# EAGLE schematic interfacez_main_r2_5 (EAGLE 6.4)
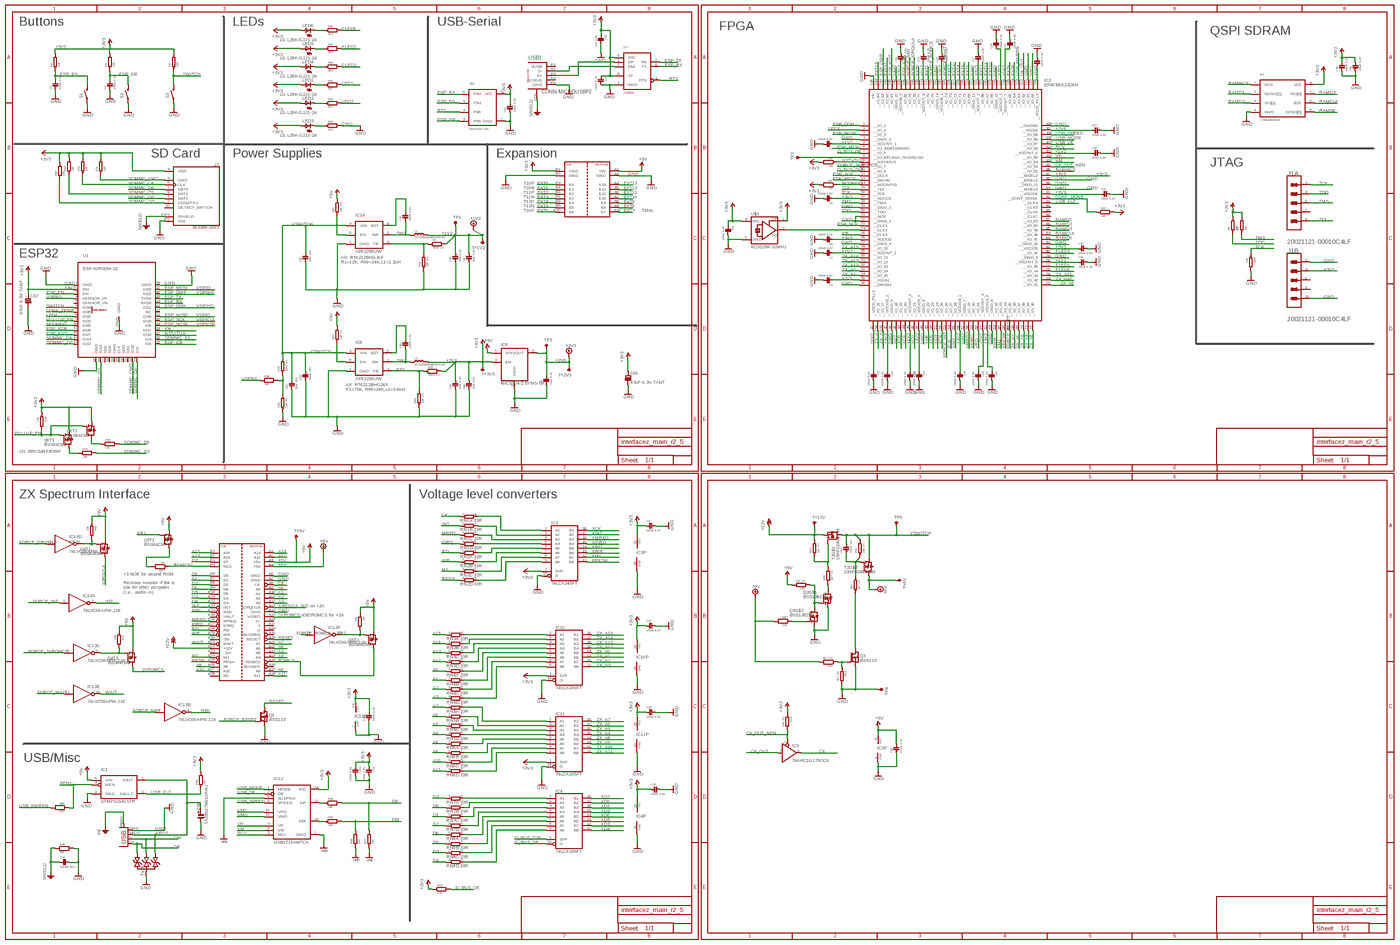
[diagram p0: schematic, sheet 1, overview]
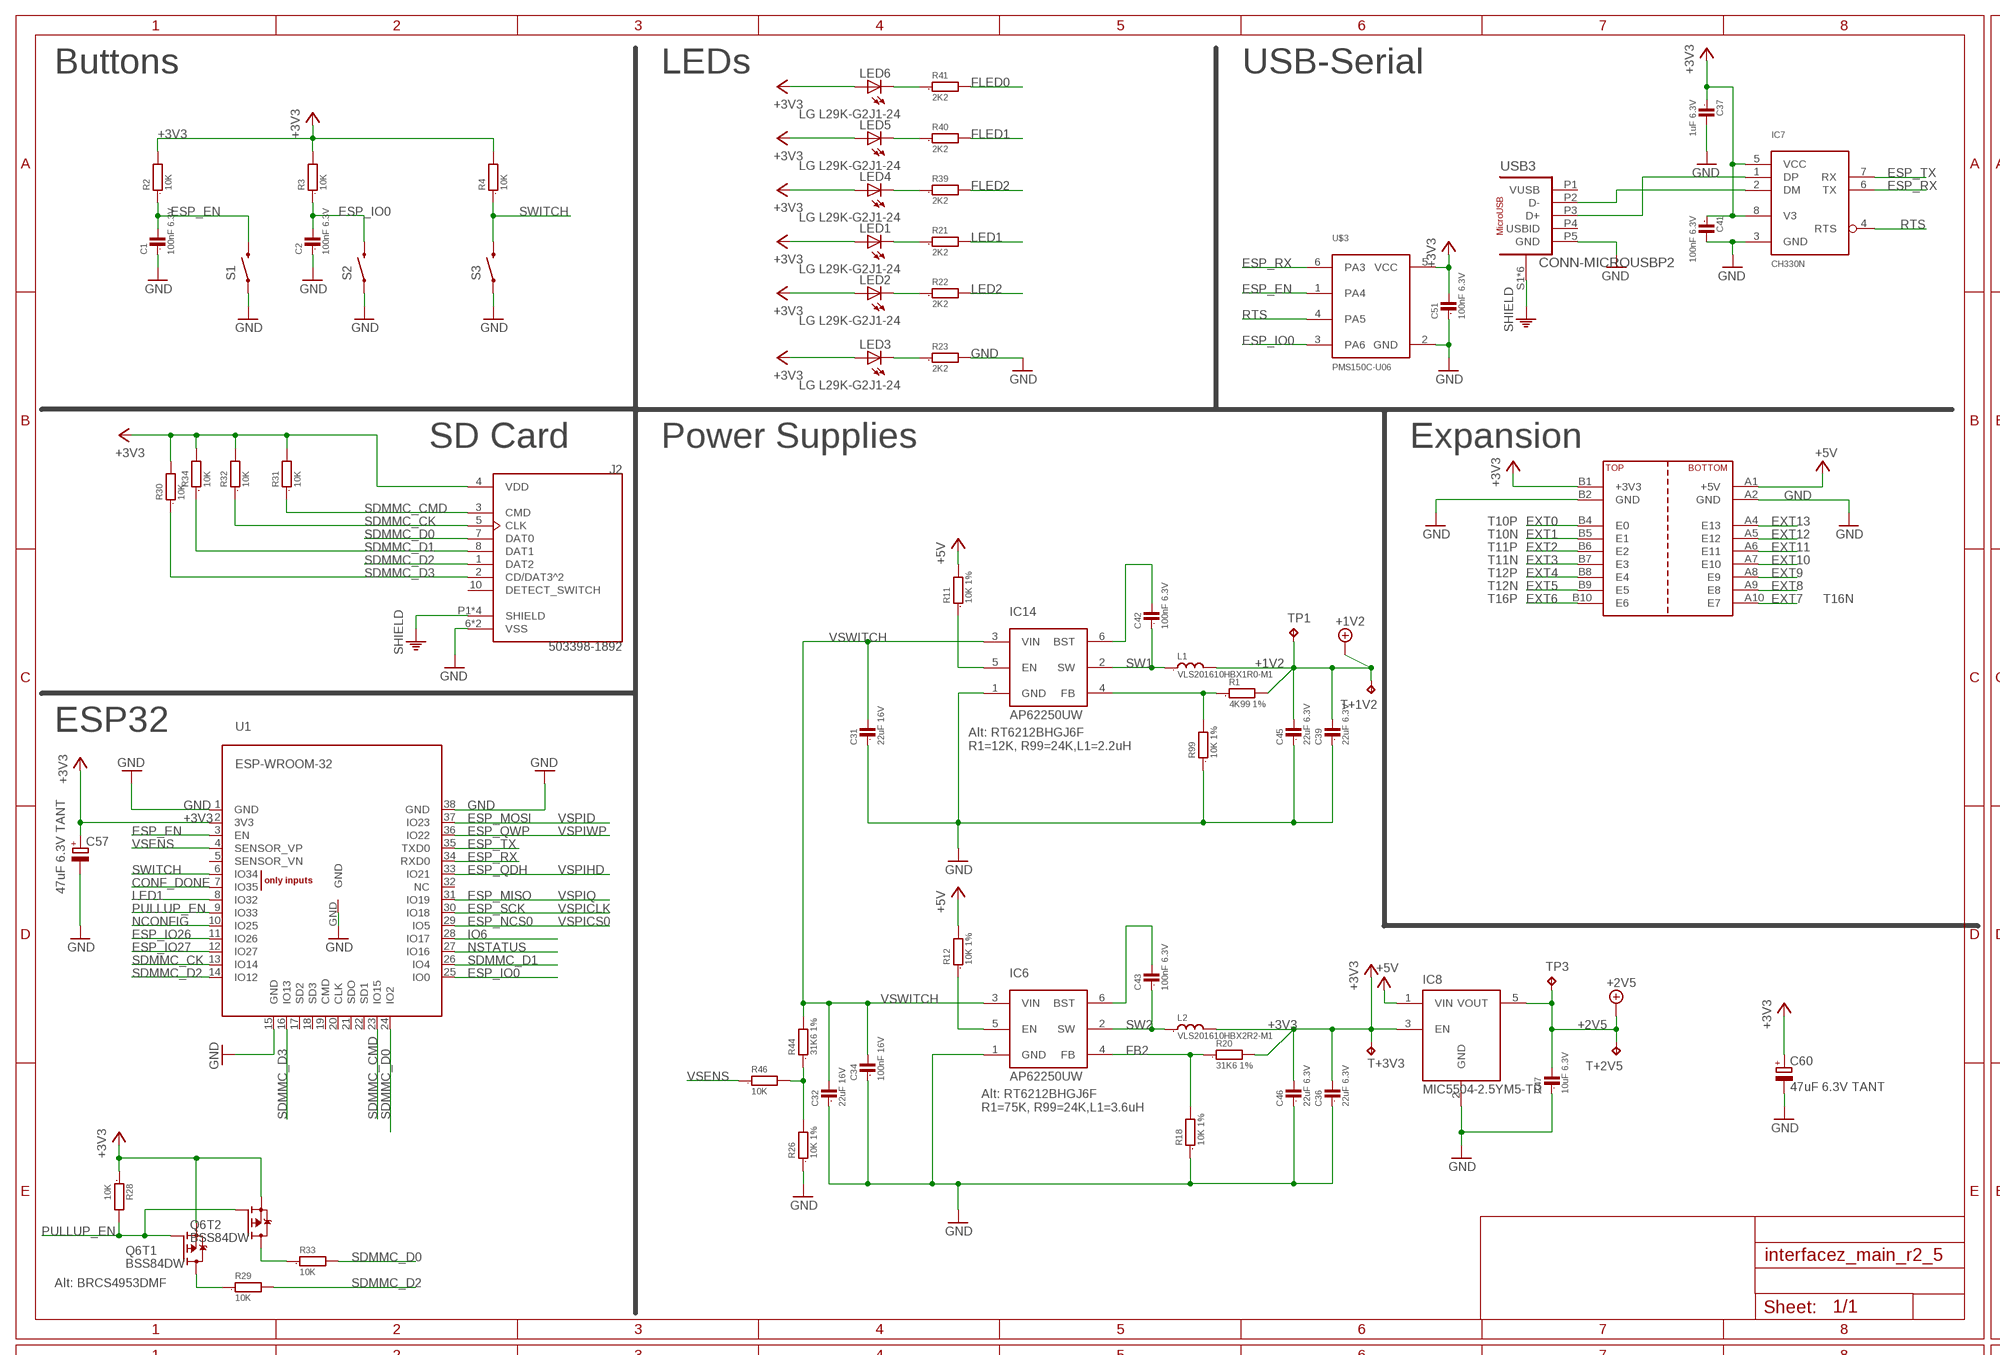
[diagram p1: schematic, sheet 1, part 1 of 4]
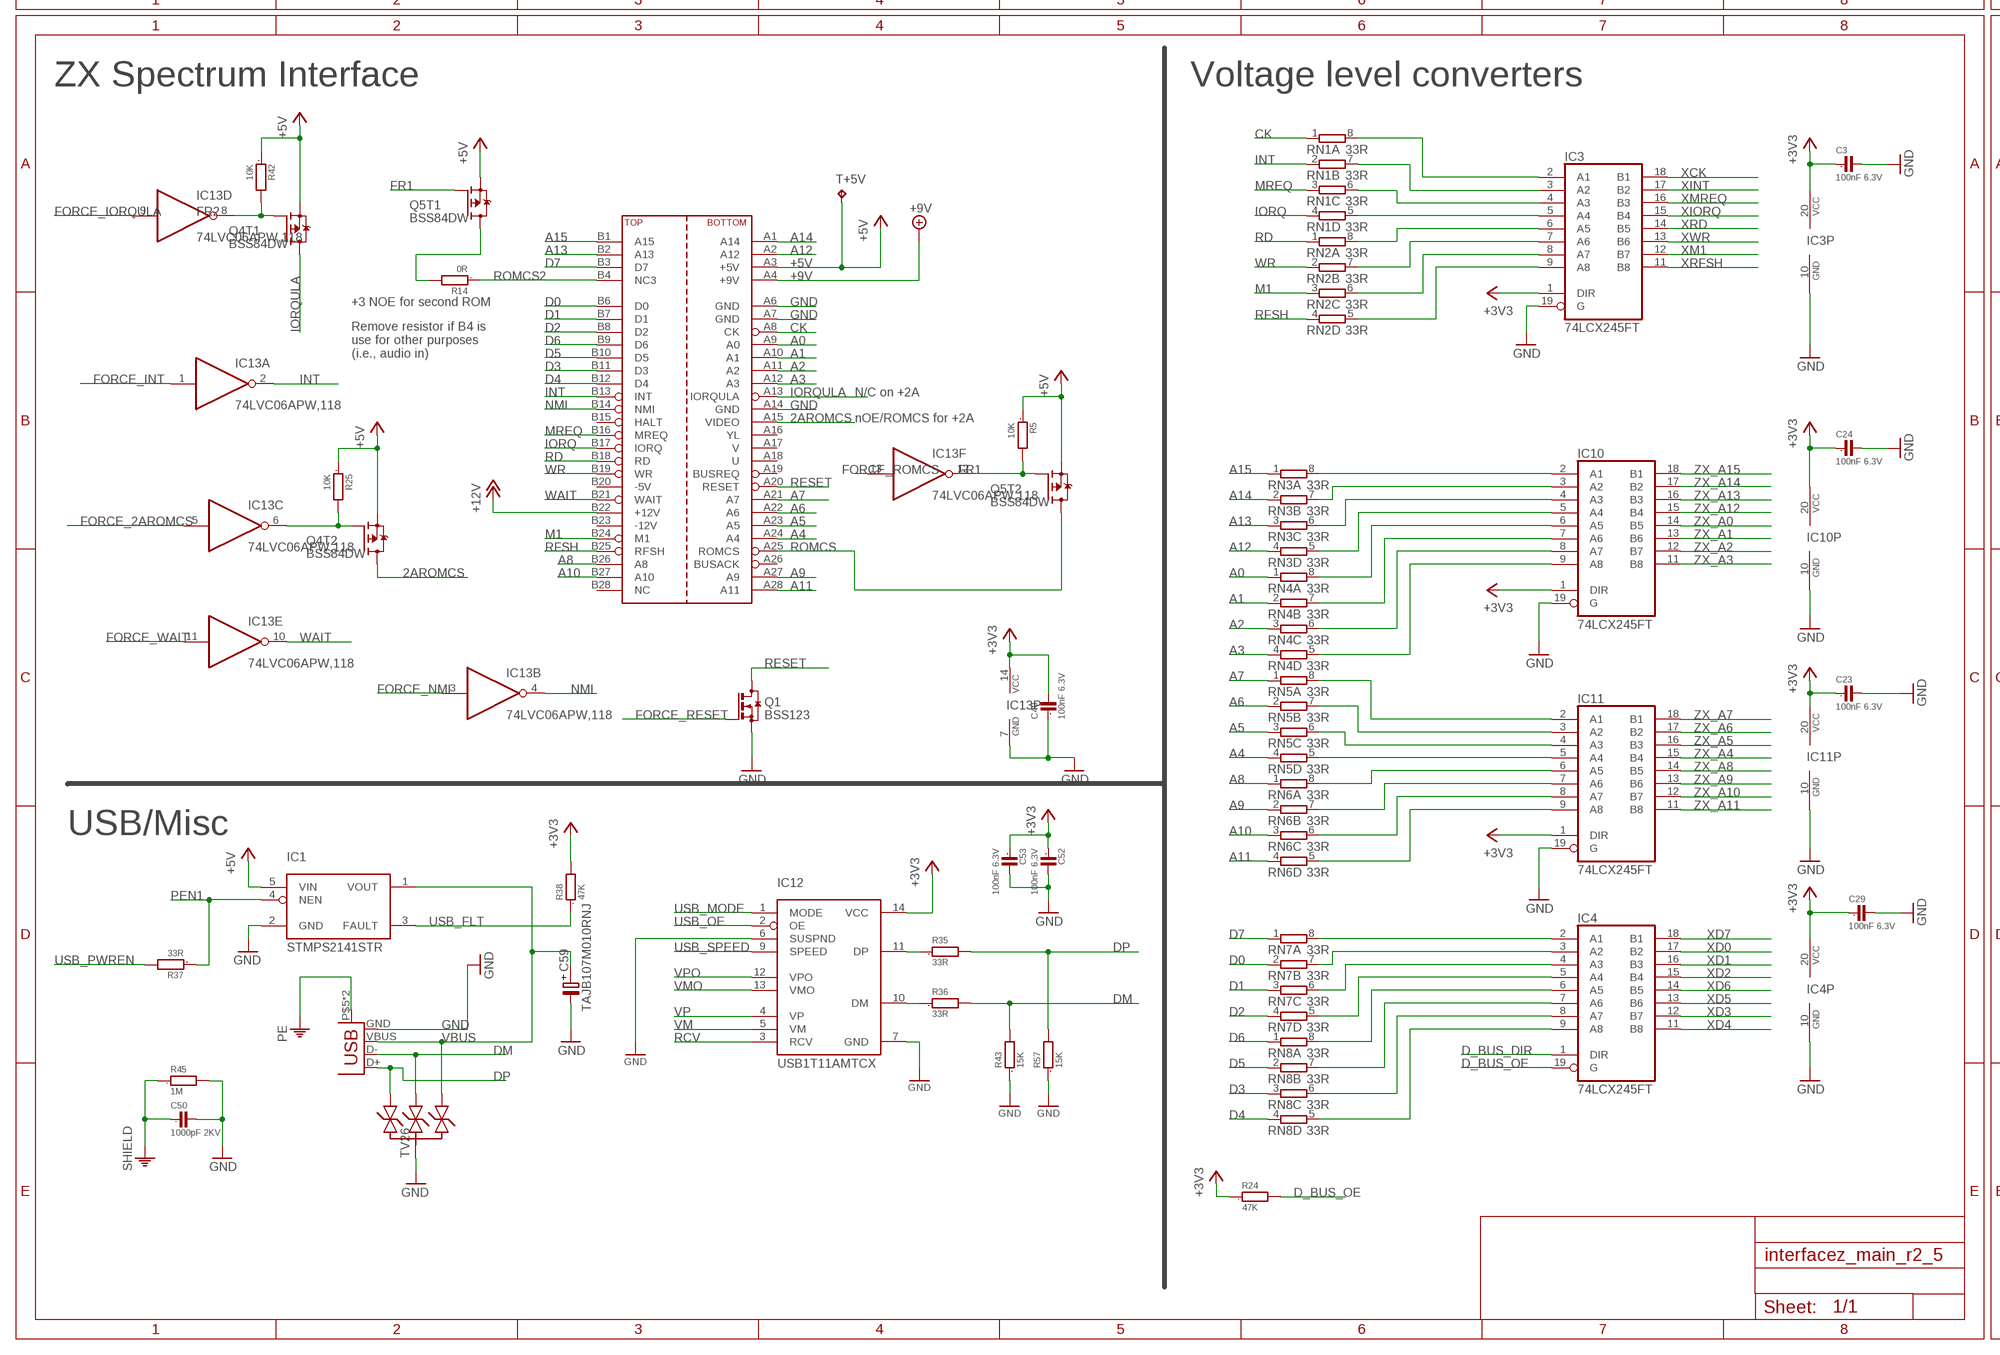
[diagram p2: schematic, sheet 1, part 2 of 4]
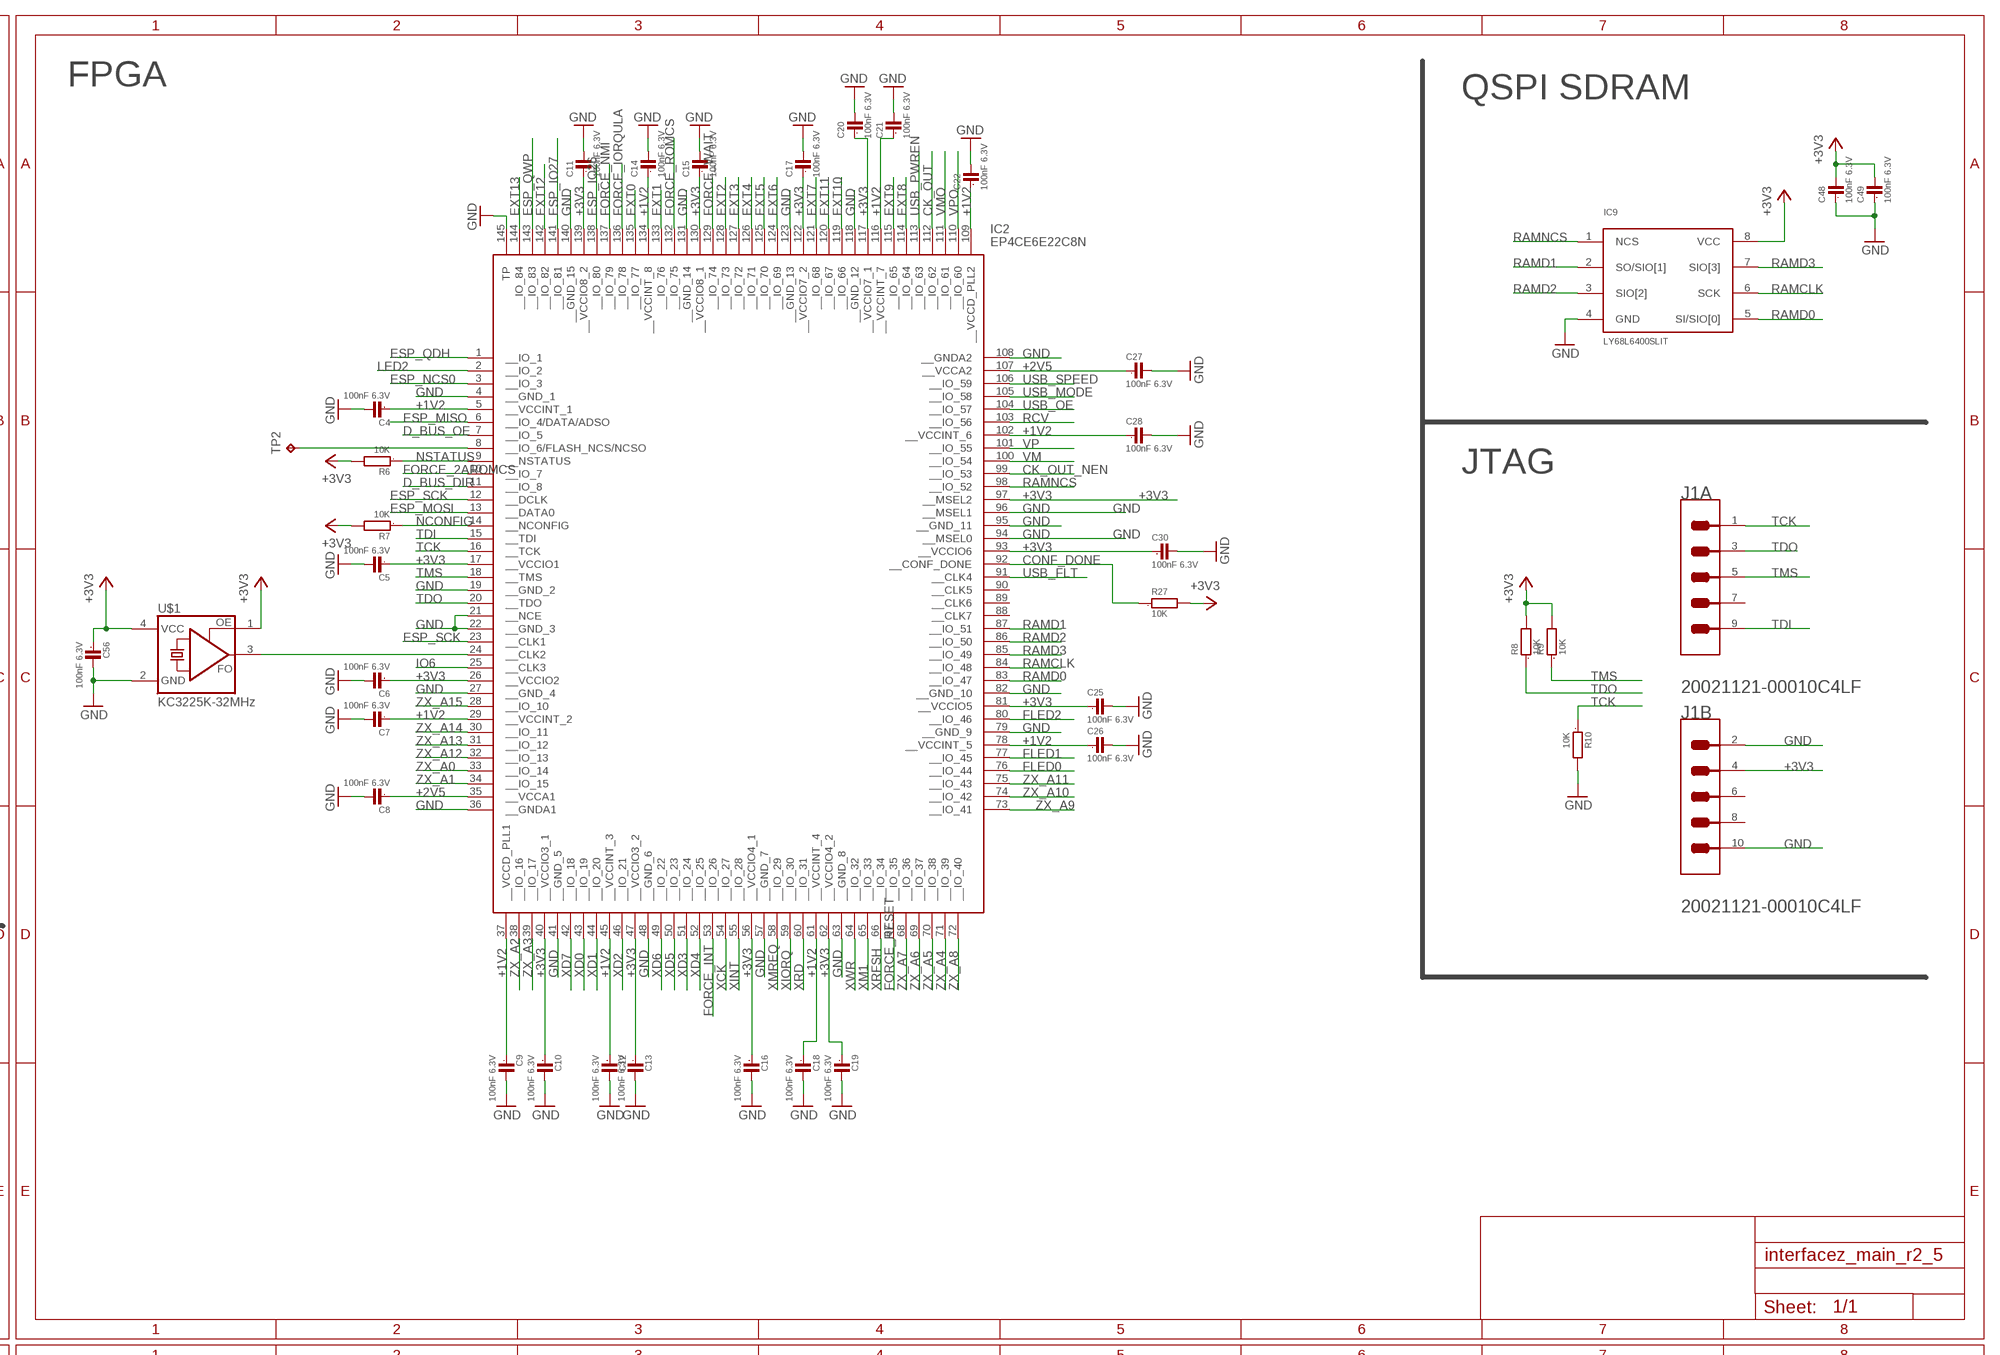
[diagram p3: schematic, sheet 1, part 3 of 4]
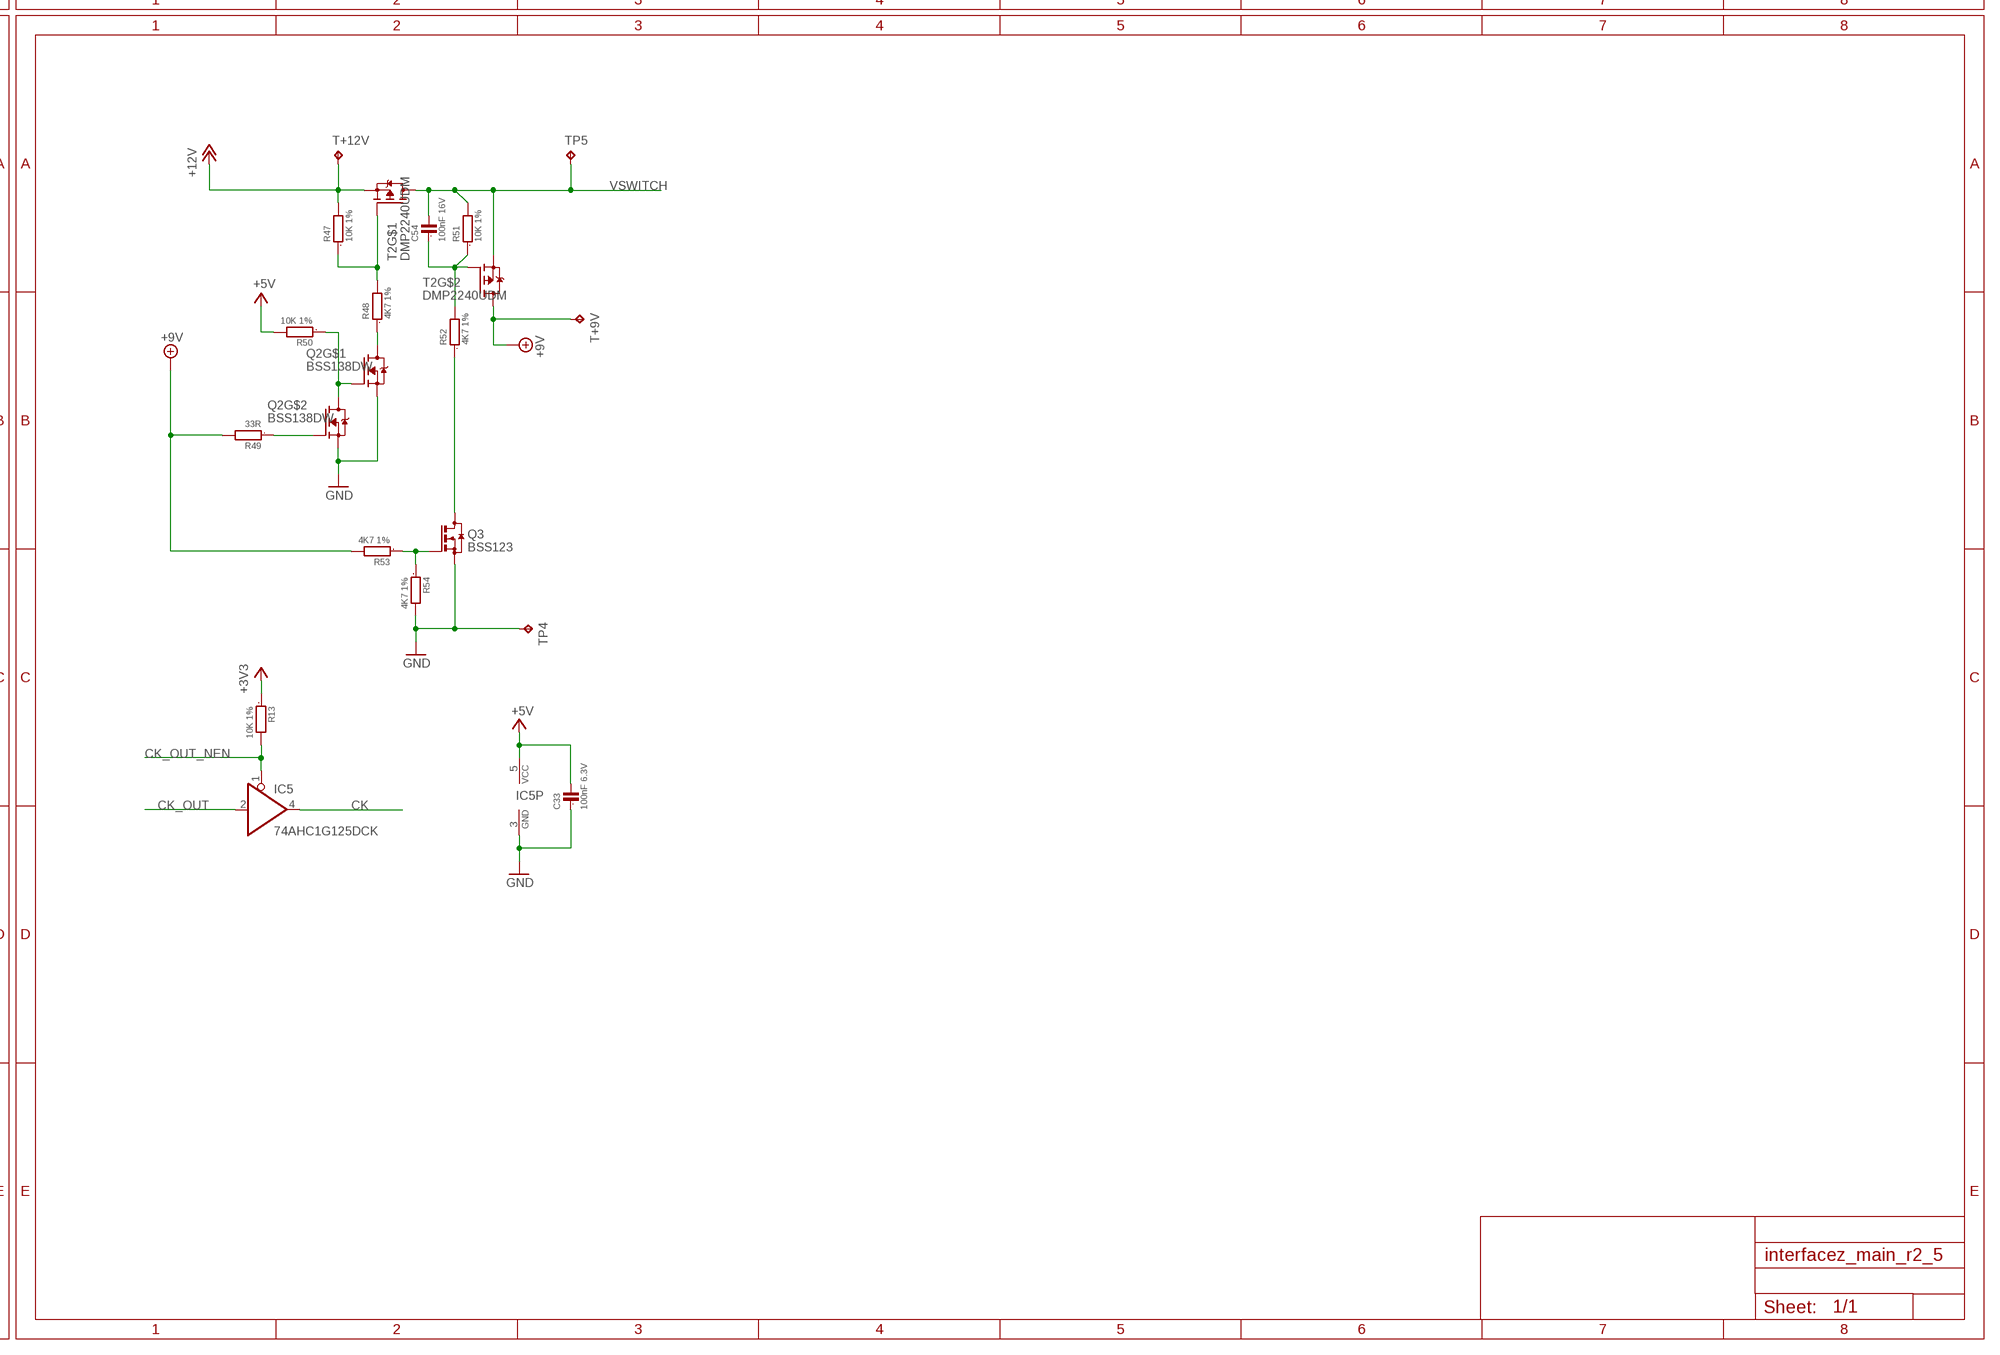
[diagram p4: schematic, sheet 1, part 4 of 4]

## Parts
C1  100nF 6.3V  C0603  [0603]
C2  100nF 6.3V  C0603  [0603]
C3  100nF 6.3V  C0603  [0603]
C4  100nF 6.3V  C0603  [0603]
C5  100nF 6.3V  C0603  [0603]
C6  100nF 6.3V  C0603  [0603]
C7  100nF 6.3V  C0603  [0603]
C8  100nF 6.3V  C0603  [0603]
C9  100nF 6.3V  C0603  [0603]
C10  100nF 6.3V  C0603  [0603]
C11  100nF 6.3V  C0603  [0603]
C12  100nF 6.3V  C0603  [0603]
C13  100nF 6.3V  C0603  [0603]
C14  100nF 6.3V  C0603  [0603]
C15  100nF 6.3V  C0603  [0603]
C16  100nF 6.3V  C0603  [0603]
C17  100nF 6.3V  C0603  [0603]
C18  100nF 6.3V  C0603  [0603]
C19  100nF 6.3V  C0603  [0603]
C20  100nF 6.3V  C0603  [0603]
C21  100nF 6.3V  C0603  [0603]
C22  100nF 6.3V  C0603  [0603]
C23  100nF 6.3V  C0603  [0603]
C24  100nF 6.3V  C0603  [0603]
C25  100nF 6.3V  C0603  [0603]
C26  100nF 6.3V  C0603  [0603]
C27  100nF 6.3V  C0603  [0603]
C28  100nF 6.3V  C0603  [0603]
C29  100nF 6.3V  C0603  [0603]
C30  100nF 6.3V  C0603  [0603]
C31  22uF 16V  C1210  [1210]
C32  22uF 16V  C1210  [1210]
C33  100nF 6.3V  C0603  [0603]
C34  100nF 16V  C0603  [0603]
C36  22uF 6.3V  C0805  [0805]
C37  1uF 6.3V  C0603  [0603]
C39  22uF 6.3V  C0805  [0805]
C40  100nF 6.3V  C0603  [0603]
C41  100nF 6.3V  C0603  [0603]
C42  100nF 6.3V  C0603  [0603]
C43  100nF 6.3V  C0603  [0603]
C45  22uF 6.3V  C0805  [0805]
C46  22uF 6.3V  C0805  [0805]
C47  10uF 6.3V  C0805  [0805]
C48  100nF 6.3V  C0603  [0603]
C49  100nF 6.3V  C0603  [0603]
C50  1000pF 2KV  C1210  [1210]
C51  100nF 6.3V  C0603  [0603]
C52  100nF 6.3V  C0603  [0603]
C53  100nF 6.3V  C0603  [0603]
C54  100nF 16V  C0603  [0603]
C56  100nF 6.3V  C0603  [0603]
C57  47uF 6.3V TANT  TANT_CASE_A  [TANT_CASE_A]
C59  TAJB107M010RNJ  C-PR-SMD-TE-B  [TE-B-3528]
C60  47uF 6.3V TANT  TANT_CASE_A  [TANT_CASE_A]
CONN1  ZX_EDGE_DAUGHTERBOARD  [ZX-EDGE-DAUGHTERBOARD]
IC1  STMPS2141STR  [SOT23-5L]
IC2  EP4CE6E22C8N  [QFP50P2200X2200X165-145N]
IC3  74LCX245FT  74245  [TSSOP20]
IC4  74LCX245FT  74245  [TSSOP20]
IC5  74AHC1G125DCK  [SC70-5]
IC6  AP62250UW  [SOT23-6]
IC7  CH330N  [SOIC8]
IC8  MIC5504-2.5YM5-TR  MIC550X  [SOT23-5L]
IC9  LY68L6400SLIT  [SOIC8]
IC10  74LCX245FT  74245  [TSSOP20]
IC11  74LCX245FT  74245  [TSSOP20]
IC12  USB1T11AMTCX  [TSSOP14]
IC13  74LVC06APW,118  [TSSOP14]
IC14  AP62250UW  [SOT23-6]
J1  AMPHENOL_ICC_-_FCI_20021121-00010C4LFAMPHENOL_ICC_-_FCI_20021121-00010C4LF_0_0  [AMPHENOL_ICC_-_FCI_20021121-00010C4LF_0]
J2  503398-1892  [MOLEX_503398-1892]
L1  VLS201610HBX1R0-M1  VLS201610HBXR68-M1  [IND_0806]
L2  VLS201610HBX2R2-M1  VLS201610HBX1R5-M1  [IND_0806]
LED1  LG L29K-G2J1-24  LED-0603  [LED-603]
LED2  LG L29K-G2J1-24  LED-0603  [LED-603]
LED3  LG L29K-G2J1-24  LED-0603  [LED-603]
LED4  LG L29K-G2J1-24  LED-0603  [LED-603]
LED5  LG L29K-G2J1-24  LED-0603  [LED-603]
LED6  LG L29K-G2J1-24  LED-0603  [LED-603]
Q1  BSS123  [SOT23]
Q2  BSS138DW  [SOT363_INFINEON]
Q3  BSS123  [SOT23]
Q4  BSS84DW  [SOT363_INFINEON]
Q5  BSS84DW  [SOT363_INFINEON]
Q6  BSS84DW  [SOT363_INFINEON]
R1  4K99 1%  R0603  [0603]
R2  10K  R0603  [0603]
R3  10K  R0603  [0603]
R4  10K  R0603  [0603]
R5  10K  R0603  [0603]
R6  10K  R0603  [0603]
R7  10K  R0603  [0603]
R8  10K  R0603  [0603]
R9  10K  R0603  [0603]
R10  10K  R0603  [0603]
R11  10K 1%  R0603  [0603]
R12  10K 1%  R0603  [0603]
R13  10K 1%  R0603  [0603]
R14  0R  R0603  [0603]
R18  10K 1%  R0603  [0603]
R20  31K6 1%  R0603  [0603]
R21  2K2  R0603  [0603]
R22  2K2  R0603  [0603]
R23  2K2  R0603  [0603]
R24  47K  R0603  [0603]
R25  10K  R0603  [0603]
R26  10K 1%  R0603  [0603]
R27  10K  R0603  [0603]
R28  10K  R0603  [0603]
R29  10K  R0603  [0603]
R30  10K  R0603  [0603]
R31  10K  R0603  [0603]
R32  10K  R0603  [0603]
R33  10K  R0603  [0603]
R34  10K  R0603  [0603]
R35  33R  R0603  [0603]
R36  33R  R0603  [0603]
R37  33R  R0603  [0603]
R38  47K  R0603  [0603]
R39  2K2  R0603  [0603]
R40  2K2  R0603  [0603]
R41  2K2  R0603  [0603]
R42  10K  R0603  [0603]
R43  15K  R0603  [0603]
R44  31K6 1%  R0603  [0603]
R45  1M  R0805  [0805]
R46  10K  R0603  [0603]
R47  10K 1%  R0603  [0603]
R48  4K7 1%  R0603  [0603]
R49  33R  R0603  [0603]
R50  10K 1%  R0603  [0603]
R51  10K 1%  R0603  [0603]
R52  4K7 1%  R0603  [0603]
R53  4K7 1%  R0603  [0603]
R54  4K7 1%  R0603  [0603]
R57  15K  R0603  [0603]
R99  10K 1%  R0603  [0603]
RN1  33R  4R-NEXB28V  [EXB28V]
RN2  33R  4R-NEXB28V  [EXB28V]
RN3  33R  4R-NEXB28V  [EXB28V]
RN4  33R  4R-NEXB28V  [EXB28V]
RN5  33R  4R-NEXB28V  [EXB28V]
RN6  33R  4R-NEXB28V  [EXB28V]
RN7  33R  4R-NEXB28V  [EXB28V]
RN8  33R  4R-NEXB28V  [EXB28V]
S1  SWITCHES_SMD-4  [TACTILE_SWITCH_TALL]
S2  SWITCHES_SMD-4  [TACTILE_SWITCH_TALL]
S3  SWITCHES_SMD-4  [TACTILE_SWITCH_TALL]
T2  DMP2240UDM  MOSFET-P-DUAL-SOT23-6  [SOT23-6]
T+1V2  TPTP12SQ  [TP12SQ]
T+2V5  TPTP12SQ  [TP12SQ]
T+3V3  TPTP12SQ  [TP12SQ]
T+5V  TPTP12SQ  [TP12SQ]
T+9V  TPTP12SQ  [TP12SQ]
T+12V  TPTP12SQ  [TP12SQ]
TP1  TPTP12R  [TP12R]
TP2  TPTP12SQ  [TP12SQ]
TP3  TPTP12R  [TP12R]
TP4  TPPAD1-13  [P1-13]
TP5  TPTP12SQ  [TP12SQ]
TV26  SP0503BAHT  [SP0503]
U1  ESP-WROOM-32  [ESP-WROOM-32]
U$1  KC3225K-32MHz  KC3225K  [KC3225K]
U$3  PMS150C-U06  [SOT23-6]
U$5  INTERFACEZ_EDGEDAUGHTER  [INTERFACEZ_EXPANSION_DAUGHTERCARD]
USB2  USB-A-H  [USB-A-H]
USB3  CONN-MICROUSBP2  [MICROUSB_SMD_TH_7.5MM_4.85MM]

## Nets
2AROMCS: CONN1.A15(VIDEO) Q4.6(T2:D)
+1V2: C4.1 C7.1 C9.1 C12.1 C14.1 C18.1 C21.1 C22.1 C26.1 C28.1 C39.2 C45.2 IC2.5(__VCCINT_1) IC2.29(__VCCINT_2) IC2.37(__VCCD_PLL1) IC2.45(__VCCINT_3) IC2.61(__VCCINT_4) IC2.78(__VCCINT_5) IC2.102(__VCCINT_6) IC2.109(__VCCD_PLL2) IC2.116(__VCCINT_7) IC2.134(__VCCINT_8) L1.P$2 R1.2 T+1V2.TP TP1.TP
+2V5: C8.1 C27.1 C47.2 IC2.35(__VCCA1) IC2.107(__VCCA2) IC8.5(VOUT) T+2V5.TP TP3.TP
+3V3: C3.1 C5.1 C6.1 C10.1 C11.1 C13.1 C15.1 C16.1 C17.1 C19.1 C20.1 C23.1 C24.1 C25.1 C29.1 C30.1 C36.2 C37.1 C40.2 C41.1 C46.2 C48.2 C49.2 C51.2 C52.1 C53.1 C56.1 C57.PLUS(+) C60.PLUS(+) IC2.17(__VCCIO1) IC2.26(__VCCIO2) IC2.40(__VCCIO3_1) IC2.47(__VCCIO3_2) IC2.56(__VCCIO4_1) IC2.62(__VCCIO4_2) IC2.81(__VCCIO5) IC2.93(__VCCIO6) IC2.97(__MSEL2) IC2.117(__VCCIO7_1) IC2.122(__VCCIO7_2) IC2.130(__VCCIO8_1) IC2.139(__VCCIO8_2) IC3.1(DIR) IC3.20(VCC) IC4.20(VCC) IC7.5(VCC) IC7.8(V3) IC8.3(EN) IC9.8(VCC) IC10.1(DIR) IC10.20(VCC) IC11.1(DIR) IC11.20(VCC) IC12.14(VCC) IC13.14(P:VCC) J1.4 J2.4(VDD) L2.P$2 LED1.A LED2.A LED3.A LED4.A LED5.A LED6.A Q6.1(T2:S) Q6.4(T1:S) R2.2 R3.2 R4.2 R6.2 R7.2 R8.2 R9.2 R13.1 R20.2 R24.1 R27.2 R28.1 R30.2 R31.2 R32.2 R34.2 R38.2 T+3V3.TP U1.2(3V3) U$1.1(OE) U$1.4(VCC) U$3.5(VCC) U$5.B1(+3V3)
+5V: C33.2 CONN1.A3(+5V) IC1.5(VIN) IC5.5(VCC) IC8.1(VIN) Q4.1(T2:S) Q4.4(T1:S) Q5.1(T2:S) Q5.4(T1:S) R5.1 R11.2 R12.2 R25.1 R42.1 R50.2 T+5V.TP U$5.A1(+5V)
+9V: CONN1.A4(+9V) R49.2 R53.2 T2.4(D) T+9V.TP
+12V: CONN1.B22(+12V) R47.2 T2.5(S) T+12V.TP
A0: CONN1.A9(A0) RN4.1
A1: CONN1.A10(A1) RN4.2
A2: CONN1.A11(A2) RN4.3
A3: CONN1.A12(A3) RN4.4
A4: CONN1.A24(A4) RN5.4
A5: CONN1.A23(A5) RN5.3
A6: CONN1.A22(A6) RN5.2
A7: CONN1.A21(A7) RN5.1
A8: CONN1.B26(A8) RN6.1
A9: CONN1.A27(A9) RN6.2
A10: CONN1.B27(A10) RN6.3
A11: CONN1.A28(A11) RN6.4
A12: CONN1.A2(A12) RN3.4
A13: CONN1.B2(A13) RN3.3
A14: CONN1.A1(A14) RN3.2
A15: CONN1.B1(A15) RN3.1
CK: CONN1.A8(CK) IC5.4(O) RN1.1
CK_OUT: IC2.112(__IO_62) IC5.2(I)
CK_OUT_NEN: IC2.99(__IO_53) IC5.1(OE) R13.2
CONF_DONE: IC2.92(__CONF_DONE) R27.1 U1.7(IO35)
D0: CONN1.B6(D0) RN7.2
D1: CONN1.B7(D1) RN7.3
D2: CONN1.B8(D2) RN7.4
D3: CONN1.B11(D3) RN8.3
D4: CONN1.B12(D4) RN8.4
D5: CONN1.B10(D5) RN8.2
D6: CONN1.B9(D6) RN8.1
D7: CONN1.B3(D7) RN7.1
D_BUS_DIR: IC2.11(__IO_8) IC4.1(DIR)
D_BUS_OE: IC2.7(__IO_5) IC4.19(G) R24.2
DM: R36.2 R43.2 TV26.3(B) USB2.D-
DP: R35.2 R57.2 TV26.2(A) USB2.D+
ESP_EN: C1.2 R2.1 S1.B2 U1.3(EN) U$3.1(PA4)
ESP_IO0: C2.2 R3.1 S2.B2 U1.25(IO0) U$3.3(PA6)
ESP_IO26: IC2.138(__IO_80) U1.11(IO26)
ESP_IO27: IC2.141(__IO_81) U1.12(IO27)
ESP_MISO: IC2.6(__IO_4/DATA/ADSO) U1.31(IO19)
ESP_MOSI: IC2.13(__DATA0) U1.37(IO23)
ESP_NCS0: IC2.3(__IO_3) U1.29(IO5)
ESP_QDH: IC2.1(__IO_1) U1.33(IO21)
ESP_QWP: IC2.143(__IO_83) U1.36(IO22)
ESP_RX: IC7.6(TX) U1.34(RXD0) U$3.6(PA3)
ESP_SCK: IC2.12(__DCLK) IC2.23(__CLK1) U1.30(IO18)
ESP_TX: IC7.7(RX) U1.35(TXD0)
EXT0: IC2.135(__IO_77) U$5.B4(E0)
EXT1: IC2.133(__IO_76) U$5.B5(E1)
EXT2: IC2.128(__IO_73) U$5.B6(E2)
EXT3: IC2.127(__IO_72) U$5.B7(E3)
EXT4: IC2.126(__IO_71) U$5.B8(E4)
EXT5: IC2.125(__IO_70) U$5.B9(E5)
EXT6: IC2.124(__IO_69) U$5.B10(E6)
EXT7: IC2.121(__IO_68) U$5.A10(E7)
EXT8: IC2.114(__IO_64) U$5.A9(E8)
EXT9: IC2.115(__IO_65) U$5.A8(E9)
EXT10: IC2.119(__IO_66) U$5.A7(E10)
EXT11: IC2.120(__IO_67) U$5.A6(E11)
EXT12: IC2.142(__IO_82) U$5.A5(E12)
EXT13: IC2.144(__IO_84) U$5.A4(E13)
FB2: IC6.4(FB) R18.2 R20.1
FLED0: IC2.76(__IO_44) R41.2
FLED1: IC2.77(__IO_45) R40.2
FLED2: IC2.80(__IO_46) R39.2
FORCE_2AROMCS: IC2.10(__IO_7) IC13.5(C:I)
FORCE_INT: IC2.53(__IO_26) IC13.1(A:I)
FORCE_IORQULA: IC2.136(__IO_78) IC13.9(D:I)
FORCE_NMI: IC2.137(__IO_79) IC13.3(B:I)
FORCE_RESET: IC2.67(__IO_35) Q1.1(G)
FORCE_ROMCS: IC2.132(__IO_75) IC13.13(F:I)
FORCE_WAIT: IC2.129(__IO_74) IC13.11(E:I)
FR1: IC13.12(F:O) Q5.2(T2:G) Q5.5(T1:G) R5.2
FR2: IC13.8(D:O) Q4.5(T1:G) R42.2
GND: C1.1 C2.1 C3.2 C4.2 C5.2 C6.2 C7.2 C8.2 C9.2 C10.2 C11.2 C12.2 C13.2 C14.2 C15.2 C16.2 C17.2 C18.2 C19.2 C20.2 C21.2 C22.2 C23.2 C24.2 C25.2 C26.2 C27.2 C28.2 C29.2 C30.2 C31.1 C32.1 C33.1 C34.1 C36.1 C37.2 C39.1 C40.1 C41.2 C45.1 C46.1 C47.1 C48.1 C49.1 C50.2 C51.1 C52.2 C53.2 C56.2 C57.MINUS(-) C59.- C60.MINUS(-) CONN1.A6(GND) CONN1.A7(GND) CONN1.A14(GND) IC1.2(GND) IC2.4(__GND_1) IC2.19(__GND_2) IC2.21(__NCE) IC2.22(__GND_3) IC2.27(__GND_4) IC2.36(__GNDA1) IC2.41(__GND_5) IC2.48(__GND_6) IC2.57(__GND_7) IC2.63(__GND_8) IC2.79(__GND_9) IC2.82(__GND_10) IC2.94(__MSEL0) IC2.95(__GND_11) IC2.96(__MSEL1) IC2.108(__GNDA2) IC2.118(__GND_12) IC2.123(__GND_13) IC2.131(__GND_14) IC2.140(__GND_15) IC2.145(TP) IC3.10(GND) IC3.19(G) IC4.10(GND) IC5.3(GND) IC6.1(GND) IC7.3(GND) IC8.2(GND) IC9.4(GND) IC10.10(GND) IC10.19(G) IC11.10(GND) IC11.19(G) IC12.6(SUSPND) IC12.7(GND) IC13.7(P:GND) IC14.1(GND) J1.2 J1.10 J2.6(VSS) J2.9(VSS) Q1.2(S) Q2.1(S) Q2.4(S) Q3.2(S) R10.2 R18.1 R23.2 R26.1 R43.1 R45.2 R54.2 R57.1 R99.1 S1.A2 S2.A2 S3.A2 TP4.TP TV26.1(COM) U1.1(GND) U1.15(GND) U1.38(GND) U1.GND U$1.2(GND) U$3.2(GND) U$5.A2(GND) U$5.B2(GND) USB2.GND USB3.P5(GND)
INT: CONN1.B13(INT) IC13.2(A:O) RN1.2
IO6: IC2.25(__CLK3) U1.28(IO17)
IORQ: CONN1.B17(IORQ) RN1.4
IORQULA: CONN1.A13(IORQULA) Q4.3(T1:D)
LED1: R21.2 U1.8(IO32)
LED2: IC2.2(__IO_2) R22.2
M1: CONN1.B24(M1) RN2.3
MREQ: CONN1.B16(MREQ) RN1.3
N$1: Q5.3(T1:D) R14.2
N$2: LED1.C R21.1
N$3: LED2.C R22.1
N$4: LED3.C R23.1
N$5: R47.1 R48.2 T2.1(G)
N$6: Q2.3(D) R48.1
N$7: IC3.2(A1) RN1.8
N$8: IC3.3(A2) RN1.7
N$9: IC10.2(A1) RN3.8
N$10: IC10.3(A2) RN3.7
N$11: IC10.4(A3) RN3.6
N$12: IC10.5(A4) RN3.5
N$13: IC2.24(__CLK2) U$1.3(FO)
N$14: IC10.6(A5) RN4.8
N$15: IC10.7(A6) RN4.7
N$16: IC4.2(A1) RN7.8
N$17: IC4.3(A2) RN7.7
N$18: IC10.8(A7) RN4.6
N$19: IC2.8(__IO_6/FLASH_NCS/NCSO) TP2.TP
N$20: LED4.C R39.1
N$21: C43.2 IC6.6(BST)
N$22: IC10.9(A8) RN4.5
N$23: IC11.2(A1) RN5.8
N$24: IC11.3(A2) RN5.7
N$25: IC11.4(A3) RN5.6
N$26: IC11.5(A4) RN5.5
N$27: IC11.6(A5) RN6.8
N$28: IC11.7(A6) RN6.7
N$29: IC11.8(A7) RN6.6
N$30: IC11.9(A8) RN6.5
N$31: IC4.4(A3) RN7.6
N$32: IC4.5(A4) RN7.5
N$33: IC4.6(A5) RN8.8
N$34: IC4.7(A6) RN8.7
N$35: IC4.8(A7) RN8.6
N$36: IC4.9(A8) RN8.5
N$37: IC3.4(A3) RN1.6
N$38: IC3.5(A4) RN1.5
N$39: IC3.6(A5) RN2.8
N$40: IC3.7(A6) RN2.7
N$41: IC3.8(A7) RN2.6
N$42: IC3.9(A8) RN2.5
N$44: C42.2 IC14.6(BST)
N$52: IC6.5(EN) R12.1
N$53: IC14.4(FB) R1.1 R99.2
N$54: IC14.5(EN) R11.1
N$55: IC13.6(C:O) Q4.2(T2:G) R25.2
N$56: Q6.3(T1:D) R29.1
N$57: LED5.C R40.1
N$58: LED6.C R41.1
N$59: IC12.11(DP) R35.1
N$60: IC12.10(DM) R36.1
N$61: Q2.5(G) Q2.6(D) R50.1
N$62: Q6.6(T2:D) R33.1
N$64: Q2.2(G) R49.1
N$66: C54.1 R51.1 R52.2 T2.3(G)
N$67: Q3.1(G) R53.1 R54.1
N$68: Q3.3(D) R52.1
N$149: IC7.1(DP) USB3.P3(D+)
N$150: IC7.2(DM) USB3.P2(D-)
NCONFIG: IC2.14(__NCONFIG) R7.1 U1.10(IO25)
NMI: CONN1.B14(NMI) IC13.4(B:O)
NSTATUS: IC2.9(__NSTATUS) R6.1 U1.27(IO16)
PE: C50.1 J2.P1(SHIELD) J2.P2(SHIELD) J2.P3(SHIELD) J2.P4(SHIELD) R45.1 USB2.P$5(SHIELD) USB2.P$6(SHIELD) USB3.S1(SHIELD) USB3.S2(SHIELD) USB3.S3(SHIELD) USB3.S4(SHIELD) USB3.S5(SHIELD) USB3.S6(SHIELD) ; supply symbol labelled SHIELD
PEN1: IC1.4(NEN) R37.1
PULLUP_EN: Q6.2(T2:G) Q6.5(T1:G) R28.2 U1.9(IO33)
RAMCLK: IC2.84(__IO_48) IC9.6(SCK)
RAMD0: IC2.83(__IO_47) IC9.5(SI/SIO[0])
RAMD1: IC2.87(__IO_51) IC9.2(SO/SIO[1])
RAMD2: IC2.86(__IO_50) IC9.3(SIO[2])
RAMD3: IC2.85(__IO_49) IC9.7(SIO[3])
RAMNCS: IC2.98(__IO_52) IC9.1(NCS)
RCV: IC2.103(__IO_56) IC12.3(RCV)
RD: CONN1.B18(RD) RN2.1
RESET: CONN1.A20(RESET) Q1.3(D)
RFSH: CONN1.B25(RFSH) RN2.4
ROMCS: CONN1.A25(ROMCS) Q5.6(T2:D)
ROMCS2: CONN1.B4(NC3) R14.1
RTS: IC7.4(RTS) U$3.4(PA5)
SDMMC_CK: J2.5(CLK) R32.1 U1.13(IO14)
SDMMC_CMD: J2.3(CMD) R31.1 U1.23(IO15)
SDMMC_D0: J2.7(DAT0) R33.2 U1.24(IO2)
SDMMC_D1: J2.8(DAT1) R34.1 U1.26(IO4)
SDMMC_D2: J2.1(DAT2) R29.2 U1.14(IO12)
SDMMC_D3: J2.2(CD/DAT3^2) R30.1 U1.16(IO13)
SW1: C42.1 IC14.2(SW) L1.P$1
SW2: C43.1 IC6.2(SW) L2.P$1
SWITCH: R4.1 S3.B2 U1.6(IO34)
TCK: IC2.16(__TCK) J1.1 R10.1
TDI: IC2.15(__TDI) J1.9
TDO: IC2.20(__TDO) J1.3 R8.1
TMS: IC2.18(__TMS) J1.5 R9.1
USB_FLT: IC1.3(FAULT) IC2.91(__CLK4) R38.1
USB_MODE: IC2.105(__IO_58) IC12.1(MODE)
USB_OE: IC2.104(__IO_57) IC12.2(OE)
USB_PWREN: IC2.113(__IO_63) R37.2
USB_SPEED: IC2.106(__IO_59) IC12.9(SPEED)
VBUS: C59.+ IC1.1(VOUT) TV26.4(C) USB2.VBUS
VDIV: R26.2 R44.1 R46.2
VM: IC2.100(__IO_54) IC12.5(VM)
VMO: IC2.111(__IO_61) IC12.13(VMO)
VP: IC2.101(__IO_55) IC12.4(VP)
VPO: IC2.110(__IO_60) IC12.12(VPO)
VSENS: R46.1 U1.4(SENSOR_VP)
VSWITCH: C31.2 C32.2 C34.2 C54.2 IC6.3(VIN) IC14.3(VIN) R44.2 R51.2 T2.2(S) T2.6(D) TP5.TP
WAIT: CONN1.B21(WAIT) IC13.10(E:O)
WR: CONN1.B19(WR) RN2.2
XCK: IC2.54(__IO_27) IC3.18(B1)
XD0: IC2.43(__IO_19) IC4.17(B2)
XD1: IC2.44(__IO_20) IC4.16(B3)
XD2: IC2.46(__IO_21) IC4.15(B4)
XD3: IC2.51(__IO_24) IC4.12(B7)
XD4: IC2.52(__IO_25) IC4.11(B8)
XD5: IC2.50(__IO_23) IC4.13(B6)
XD6: IC2.49(__IO_22) IC4.14(B5)
XD7: IC2.42(__IO_18) IC4.18(B1)
XINT: IC2.55(__IO_28) IC3.17(B2)
XIORQ: IC2.59(__IO_30) IC3.15(B4)
XM1: IC2.65(__IO_33) IC3.12(B7)
XMREQ: IC2.58(__IO_29) IC3.16(B3)
XRD: IC2.60(__IO_31) IC3.14(B5)
XRFSH: IC2.66(__IO_34) IC3.11(B8)
XWR: IC2.64(__IO_32) IC3.13(B6)
ZX_A0: IC2.33(__IO_14) IC10.14(B5)
ZX_A1: IC2.34(__IO_15) IC10.13(B6)
ZX_A2: IC2.38(__IO_16) IC10.12(B7)
ZX_A3: IC2.39(__IO_17) IC10.11(B8)
ZX_A4: IC2.71(__IO_39) IC11.15(B4)
ZX_A5: IC2.70(__IO_38) IC11.16(B3)
ZX_A6: IC2.69(__IO_37) IC11.17(B2)
ZX_A7: IC2.68(__IO_36) IC11.18(B1)
ZX_A8: IC2.72(__IO_40) IC11.14(B5)
ZX_A9: IC2.73(__IO_41) IC11.13(B6)
ZX_A10: IC2.74(__IO_42) IC11.12(B7)
ZX_A11: IC2.75(__IO_43) IC11.11(B8)
ZX_A12: IC2.32(__IO_13) IC10.15(B4)
ZX_A13: IC2.31(__IO_12) IC10.16(B3)
ZX_A14: IC2.30(__IO_11) IC10.17(B2)
ZX_A15: IC2.28(__IO_10) IC10.18(B1)
Unconnected: CONN1.A16(YL) CONN1.A17(V) CONN1.A18(U) CONN1.A19(BUSREQ) CONN1.A26(BUSACK) CONN1.B15(HALT) CONN1.B28(NC) IC2.88(__CLK7) IC2.89(__CLK6) IC2.90(__CLK5) J1.6 J1.7 J1.8 J2.10(DETECT_SWITCH) U1.5(SENSOR_VN) U1.17(SD2) U1.18(SD3) U1.19(CMD) U1.20(CLK) U1.21(SDO) U1.22(SD1) U1.32(NC) USB3.P1(VUSB) USB3.P4(USBID)

## Notes on the sheet
- Buttons | LEDs | USB-Serial
- FPGA
- QSPI SDRAM
- SD Card | Power Supplies | Expansion
- JTAG
- T10P
- T10N
- T11P
- T11N
- T12P
- T12N
- T16P | T16N
- ESP32
- Alt: RT6212BHGJ6F
  R1=12K, R99=24K,L1=2.2uH
- VSPID
- VSPIWP
- VSPIHD
- VSPIQ
- VSPICLK
- VSPICS0
- Alt: RT6212BHGJ6F
  R1=75K, R99=24K,L1=3.6uH
- Alt: BRCS4953DMF
- ZX Spectrum Interface | Voltage level converters
- +3 NOE for second ROM
- Remove resistor if B4 is
  use for other purposes
  (i.e., audio in)
- N/C on +2A
- nOE/ROMCS for +2A
- USB/Misc

## Power pins joined to a net without a drawn wire
-5V: CONN1.B20(-5V)
-12V: CONN1.B23(-12V)

## Library data of the parts
C1-C34 C36 C37 C39-C43 C45-C54 C56 = GadgetFactory:C: CAPACITOR, European symbol
C57 C60 = alvie:TANT_CASE_A
C59 = cap-pan40:C-PR: POLARIZED ELECTROLYTIC/TANTALUM
CONN1 = zxspectrum:ZX_EDGE_DAUGHTERBOARD
IC1 = alvie:STMPS2141STR
IC2 = SamacSys_Parts:EP4CE6E22C8N: FPGA Cyclone IV 6272 Cells TQFP144 EP4CE6E22C8N, FPGA Cyclone IV E 6272 Cells, 270kbit, 392 Blocks, 1.15 1.25 V 144-Pin EQFP Source: Datasheet <https://componentsearchengine.com/Datasheets/1/EP4CE6E22C8N.pdf>; DESCRIPTION: FPGA Cyclone IV 6272 Cells TQFP144 EP4CE6E22C8N, FPGA Cyclone IV E 6272 Cells, 270kbit, 392 Blocks, 1.15 1.25 V 144-Pin EQFP; HEIGHT: 1.65mm; MANUFACTURER_NAME: Intel; MANUFACTURER_PART_NUMBER: EP4CE6E22C8N; MOUSER_PART_NUMBER: 989-EP4CE6E22C8N; MOUSER_PRICE-STOCK: https://www.mouser.com/Search/Refine.aspx?Keyword=989-EP4CE6E22C8N
IC3 IC4 IC10 IC11 = GadgetFactory:74*245: Octal BUS TRANSCEIVER, 3-state
IC5 = 74xx-little-de:74*1G125: Single Bus Buffer Gate with 3-State Output
IC6 IC14 = alvie:AP62250
IC7 = alvie:CH330N
IC8 = alvie:MIC550X
IC9 = alvie:LY68L6400
IC12 = alvie:USB1T*
IC13 = 74xx-eu:74*06: Hex INVERTER, open collector high-voltage output
J1 = 20021121-00010C4LF:AMPHENOL_ICC_-_FCI_20021121-00010C4LF: Connector Header Surface Mount 10 position 0.050" (1.27mm); AUTOMOTIVE: No; CENTROID_NOT_SPECIFIED: No; CONN_GENDER: Male; CONN_ORIENTATION: Vertical; CONTACT_MATERIAL: Gold,Nickel; CURRENT_RATING: 1A; DATASHEET: https://cdn.amphenol-icc.com/media/wysiwyg/files/documentation/datasheet/boardwiretoboard/bwb_minitek127_btb.pdf; DEVICE_CLASS_L1: Connectors; DEVICE_CLASS_L2: Headers and Wire Housings; DEVICE_CLASS_L3: unset; DIGIKEY_DESCRIPTION: CONN HEADER SMD 10POS 1.27MM; DIGIKEY_PART_NUMBER: 609-3695-1-ND; FOOTPRINT_URL: https://cdn.amphenol-icc.com/media/wysiwyg/files/drawing/20021121.pdf; FOOTPRINT_VARIANT_NAME_0: Recommended_Land_Pattern; HEIGHT: 4.8mm; LEAD_FREE: Yes; MF: Amphenol ICC / FCI; MFG_PACKAGE_IDENT: 0; MFG_PACKAGE_IDENT_DATE: 0; MFG_PACKAGE_IDENT_REV: 0; MOUSER_DESCRIPTION: Conn; Rect; BrdtoBrd; UnshroudedHeader; 10Cnts; SMT; 1.27x1.27mmSpng; MOUSER_PART_NUMBER: 649-202112100010C4LF; MPN: 20021121-00010C4LF; NUMBER_OF_CONTACTS: 10; NUMBER_OF_ROWS: 2; PACKAGE: HDR10; PITCH: 1.27mm; PREFIX: J; ROHS: Yes; TEMPERATURE_RANGE_HIGH: +125°C; TEMPERATURE_RANGE_LOW: -55°C; VERIFICATION_VERSION: 0.0.0.3; VOLTAGE_RATING: 125V
J2 = 503398-1892:503398-1892: 1.10mm Pitch microSD Memory Card Connector, Normal Mount Surface Mount, Push-Push Type, 1.28mm Height Check prices <https://pricing.snapeda.com/parts/503398-1892/Molex/view-part?ref=eda>; AVAILABILITY: Warning; DESCRIPTION: 9 (8 + 1) Position Card Connector microSD™ Surface Mount, Right Angle Gold; MF: Molex; MP: 503398-1892; PACKAGE: None; PRICE: None; PURCHASE-URL: https://pricing.snapeda.com/search/part/503398-1892/?ref=eda
L1 L2 = alvie:VLS201610HBX
LED1-LED6 = dp_devices:LED: Light Emitting Diode
Q1 Q3 = transistor-small-signal:BSS123: N-CHANNEL MOS FET
Q2 = alvie:BSS138DW
Q4-Q6 = alvie:BSS84DW
R1-R14 R18 R20-R54 R57 R99 = GadgetFactory:R: RESISTOR, European symbol
RN1-RN8 = resistor-dil:4R-N: Array Chip Resistor Source: RS Component / Phycomp; OC_FARNELL: unknown; OC_NEWARK: unknown
S1-S3 = EAGLE_BoosterPack_Library:SWITCHES_: Various NO switches- pushbuttons, reed, etc
T2 = alvie:MOSFET-P-DUAL
T+1V2 T+2V5 T+3V3 T+5V T+9V T+12V TP1-TP5 = testpad:TP: Test pad
TV26 = alvie:SP0503BAHT
U1 = esp32:ESP-WROOM-32
U$1 = alvie:KC3225K
U$3 = alvie:PMS150C-U06
U$5 = alvie:INTERFACEZ_EDGE
USB2 = con-usb:USB: USB Connectors
USB3 = alvie:CONN-MICROUSB